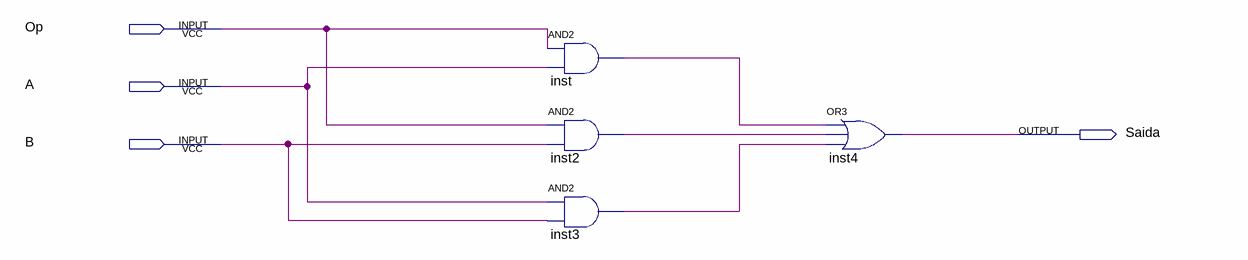
[diagram p0: schematic sheet]
// Quartus schematic And_OR_Bit.bdf as structural Verilog: 4 symbols, 4 pins
module And_OR_Bit (
  input  Op,
  input  A,
  input  B,
  output Saida
);

  wire inst2_out, inst3_out, inst_out;

  and inst (inst_out, Op, A);
  and inst2 (inst2_out, Op, B);
  and inst3 (inst3_out, A, B);
  or inst4 (Saida, inst_out, inst2_out, inst3_out);
endmodule
